# Altium schematic sheet Power.SchDoc: Power
size A4; SheetNumber: 3; SheetTotal: 4
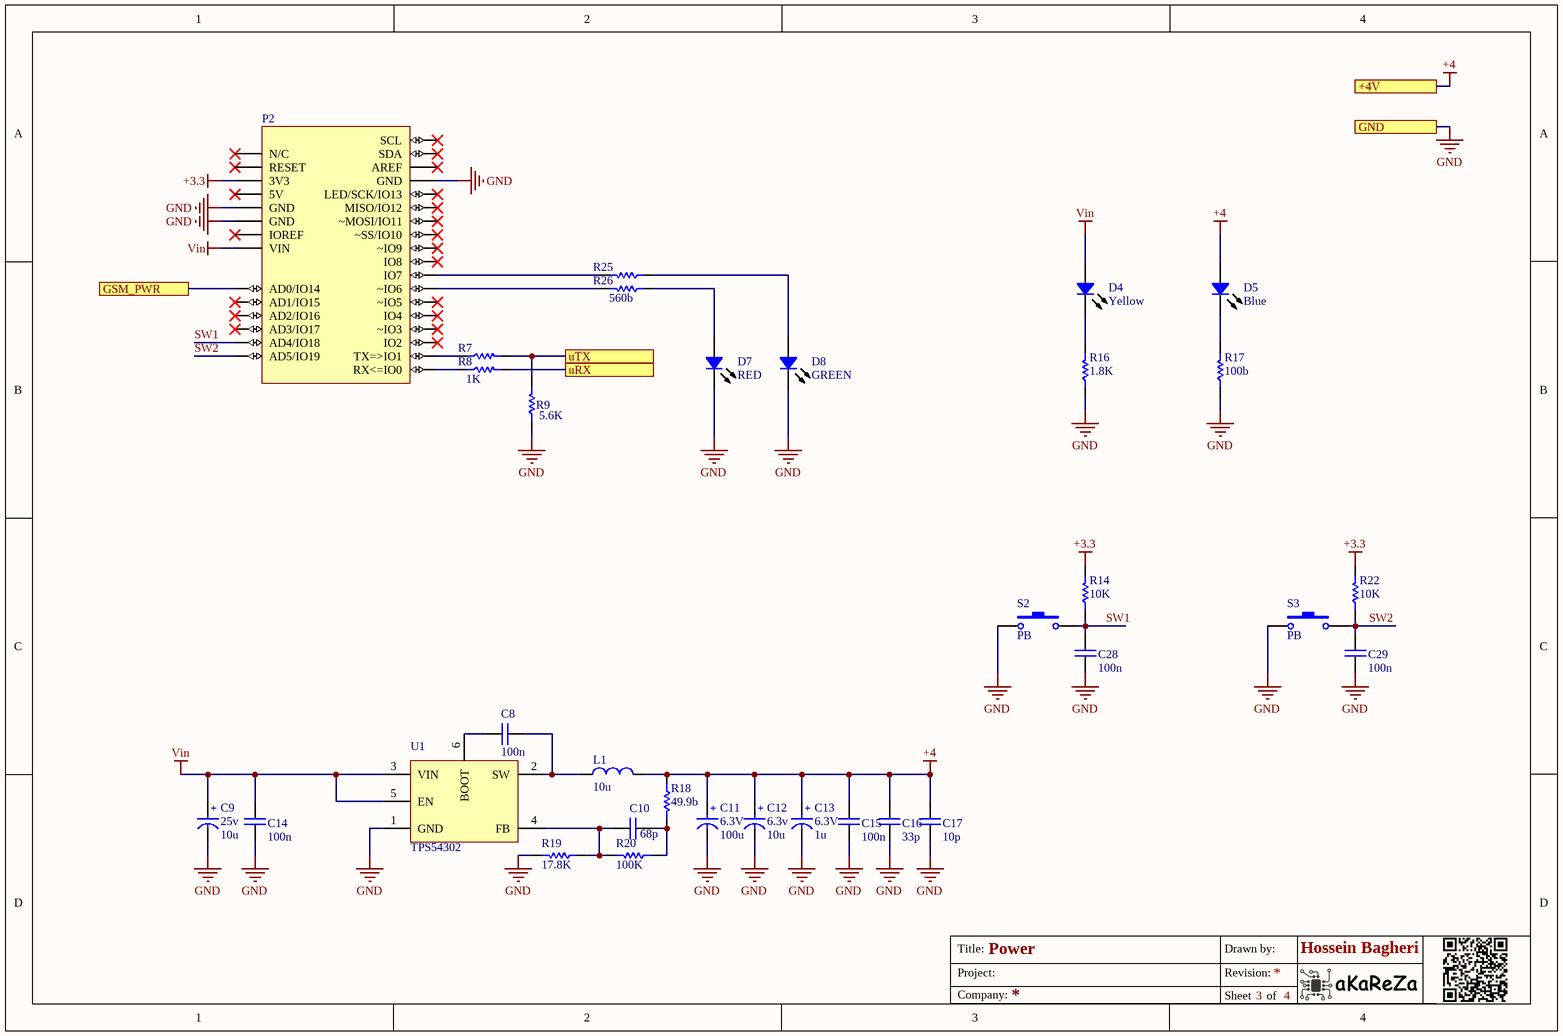
[diagram p0: Power.SchDoc]

## Parts
C8  100n  [CAP 0805/2012]
C9  Rating: 25v  [SMT_C_Tantalum_B]  (hidden comment: 10u)
C10  68p  [CAP 0805/2012]
C11  Rating: 6.3V  [SMT_C_Tantalum_C]  (hidden comment: 100u)
C12  Rating: 6.3v  [SMT_C_Tantalum_A]  (hidden comment: 10u)
C13  Rating: 6.3V  [SMT_C_Tantalum_A]  (hidden comment: 1u)
C14  100n  [CAP 1206/3216]
C15  100n  [CAP 1206/3216]
C16  33p  [CAP 1206/3216]
C17  10p  [CAP 1206/3216]
C28  100n  [CAP 0805/2012]
C29  100n  [CAP 0805/2012]
D4  Yellow  [LED 0805/2012 YELLOW]
D5  Blue  [LED 0805/2012 BLUE]
D7  RED  [LED 0805/2012 RED]
D8  GREEN  [LED 0805/2012 GREEN]
L1  10u  [L_7]
P2  UNO  [Arduino_uno_S_3]  (value not drawn)  (no BOM)
R7  1K  [RES 0805 (2012X06L)]  (value not drawn)
R8  1K  [RES 0805 (2012X06L)]
R9  5.6K  [RES 0805 (2012X06L)]
R14  10K  [RES 0805 (2012X06L)]
R16  1.8K  [RES 0805 (2012X06L)]
R17  100b  [RES 0805 (2012X06L)]
R18  49.9b  [RES 0805 (2012X06L)]
R19  17.8K  [RES 0805 (2012X06L)]
R20  100K  [RES 0805 (2012X06L)]
R22  10K  [RES 0805 (2012X06L)]
R25  560b  [RES 0805 (2012X06L)]  (value not drawn)
R26  560b  [RES 0805 (2012X06L)]
S2  PB  [SW_PB_SMD_2PIN_SPST_6X3X2]
S3  PB  [SW_PB_SMD_2PIN_SPST_6X3X2]
U1  TPS54302  [TPS54302]

## Ports
+4V, GND, GSM_PWR, uRX, uTX

## Nets
+3.3: P2.4(3V3) R14.2 R22.2
+4: C11.1(+) C12.1(+) C13.1(+) C15.1 C16.1 C17.1 D5.1 L1.2 R18.1 ; port +4V
GND: C9.2(-) C11.2(-) C12.2(-) C13.2(-) C14.2 C15.2 C16.2 C17.2 C28.2 C29.2 D7.2 D8.2 P2.6(GND) P2.7(GND) P2.29(GND) R9.1 R16.1 R17.1 R19.2 S2.2 S3.2 U1.1(GND) ; port GND
Vin: C9.1(+) C14.1 D4.1 P2.8(VIN) U1.3(VIN) U1.5(EN)
GSM_PWR: P2.9(AD0/IO14) ; port GSM_PWR
SW1: C28.1 P2.13(AD4/IO18) R14.1 S2.1
SW2: C29.1 P2.14(AD5/IO19) R22.1 S3.1
uRX: R8.2 ; port uRX
uTX: R7.2 R9.2 ; port uTX
NetC8_1: C8.1 U1.6(BOOT)
NetC8_2: C8.2 L1.1 U1.2(SW)
NetC10_1: C10.1 R19.1 R20.2 U1.4(FB)
NetC10_2: C10.2 R18.2 R20.1
NetD4_2: D4.2 R16.2
NetD5_2: D5.2 R17.2
NetD7_1: D7.1 R26.1
NetD8_1: D8.1 R25.1
NetP2_15: P2.15(RX<=IO0) R8.1
NetP2_16: P2.16(TX=>IO1) R7.1
NetP2_21: P2.21(~IO6) R26.2
NetP2_22: P2.22(IO7) R25.2

Not connected (* = marked no-connect by the designer): P2 1(N/C)* 2(IOREF)* 3(RESET)* 5(5V)* 10(AD1/IO15)* 11(AD2/IO16)* 12(AD3/IO17)* 17(IO2)* 18(~IO3)* 19(IO4)* 20(~IO5)* 23(IO8)* 24(~IO9)* 25(~SS/IO10)* 26(~MOSI/IO11)* 27(MISO/IO12)* 28(LED/SCK/IO13)* 30(AREF)* 31(SDA)* 32(SCL)*

## Notes on the sheet
- Title:
- Project:
- Drawn by:
- Revision:
- Hossein Bagheri
- Company:
- Sheet
- of

## Library data of the parts
C8 C28 C29 = Cap_Multi_SMD_100nF_0805: Bipolar ceramic capacitor SMD; Inflow: inflow?; Type: MultiLayer; Rating: 50V; Validation: Valid; Package: 0805; Value: 100n
C9 C12 = Cap_Tantalum: Tantalum Capacitor,TAJ Series-SMD; Inflow: inflow?; Validation: Valid; Package: Package?; Type: Tantalum; Value: 10u
C10 = Cap_Multi_SMD_0805: Bipolar ceramic capacitor SMD; Inflow: inflow?; Type: MultiLayer; Rating: Rating?; Validation: Valid; Package: 0805; Value: 68p
C11 C13 = Cap_Tantalum: Tantalum Capacitor,TAJ Series-SMD; Inflow: inflow?; Type: Tantalum
  C11: Package: SMD-C; Value: 100u
  C13: Package: SMD-A; Value: 1u
C14 = Cap_Multi_SMD_100nF_1206: Bipolar ceramic capacitor SMD; Type: MultiLayer; Inflow: inflow?; Rating: 50V; Validation: Valid; Package: 1206; Value: 100n
C15 = Cap_Multi_SMD_100nF_1206: Bipolar ceramic capacitor SMD; Type: MultiLayer; Inflow: inflow?; Rating: 50V; Package: 1206; Value: 100n
C16 C17 = Cap_Multi_SMD_1206: Bipolar ceramic capacitor SMD; Inflow: inflow?; Type: MultiLayer; Rating: 50V; Package: 1206
  C16: Value: 33p
  C17: Value: 10p
D4 D5 D7 D8 = Semi_LED_SMD: LED; Inflow: inflow?; Rating: Rating?; Validation: Valid; Package: Package?; Type: LED
  D4: Value: Yellow
  D5: Value: Blue
  D7: Value: RED
  D8: Value: GREEN
L1 = Ind_SMD: Inductor; Inflow: inflow?; Type: Type?; Rating: 3.8A; Validation: Valid; Package: Package?; Value: 10u
P2 = Con_Arduino_UNO_S: Arduino uno slave; Inflow: inflow?; Rating: Rating?; Validation: Valid; Value: UNO; Package: Package?; Type: Type?
R7-R9 R14 R16-R20 R22 R25 R26 = Res_SMD_0805: Resistor; Inflow: inflow?; Rating: 0.125W; Validation: Valid; Package: 0805
  R7 R8: Type: 10%; Value: 1K
  R9: Type: 10%; Value: 5.6K
  R14 R22: Type: 10%; Value: 10K
  R16: Type: 10%; Value: 1.8K
  R17: Type: 10%; Value: 100b
  R18: Type: 1%; Value: 49.9b
  R19: Type: 1%; Value: 17.8K
  R20: Type: 1%; Value: 100K
  R25 R26: Type: 10%; Value: 560b
S2 S3 = SW_PushButton_2_SMD: SMT Tactile ‎Switch; Rating: 2b; Validation: Valid; Inflow: 8260; Type: Vertical; Package: SMD; Value: PB
U1 = IC_Reg_TPS54302: 3'A Synchronous Step-Down Converter; Rating: S; Inflow: inflow?; Validation: Valid; Value: TPS54302; Type: Switching; Package: SOT-23-6